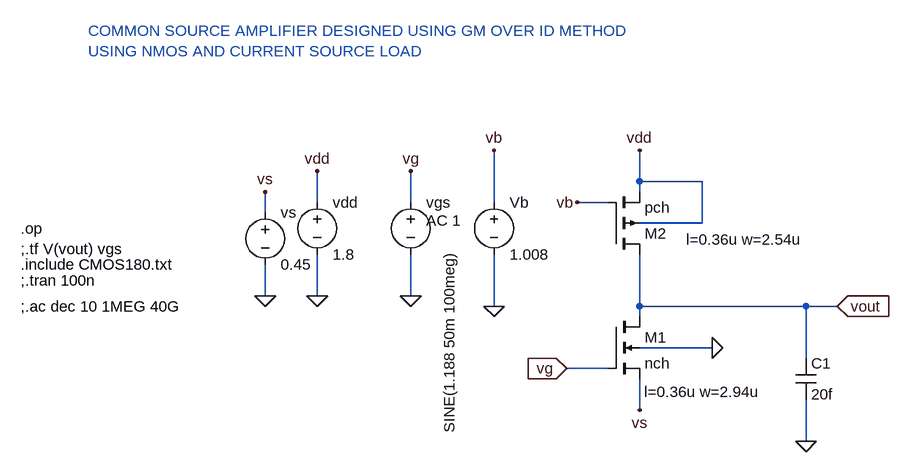
[diagram p0: schematic CS AMP FOR ONE STAGE OPAMP new.asc]
CS AMP FOR ONE STAGE OPAMP new.asc, the LTspice schematic file:
Version 4
SHEET 1 880 680
WIRE 368 96 368 48
WIRE 464 96 368 96
WIRE 368 112 368 96
WIRE -128 128 -128 80
WIRE 16 128 16 80
WIRE 144 128 144 48
WIRE 320 128 272 128
WIRE -208 144 -208 112
WIRE 464 160 464 96
WIRE 464 160 368 160
WIRE -208 272 -208 224
WIRE -128 272 -128 208
WIRE 16 272 16 208
WIRE 144 288 144 208
WIRE 368 288 368 208
WIRE 624 288 368 288
WIRE 672 288 624 288
WIRE 368 304 368 288
WIRE 480 352 368 352
WIRE 624 368 624 288
WIRE 320 384 256 384
WIRE 368 448 368 400
WIRE 624 496 624 432
FLAG 16 272 0
FLAG -128 272 0
FLAG -208 272 0
FLAG -208 112 vs
FLAG -128 80 vdd
FLAG 16 80 vg
FLAG 256 384 vg
IOPIN 256 384 In
FLAG 672 288 vout
IOPIN 672 288 In
FLAG 624 496 0
FLAG 368 48 vdd
FLAG 144 288 0
FLAG 144 48 vb
FLAG 272 128 vb
FLAG 368 448 vs
FLAG 480 352 0
DATAFLAG 368 240 ""
DATAFLAG 368 240 ""
SYMBOL nmos4 320 304 R0
WINDOW 123 55 116 Left 2
SYMATTR Value2 l=0.36u w=2.94u
SYMATTR InstName M1
SYMATTR Value nch
SYMBOL voltage 16 112 R0
WINDOW 3 59 90 VRight 2
WINDOW 123 24 44 Left 2
WINDOW 39 0 0 Left 0
SYMATTR Value SINE(1.188 50m 100meg)
SYMATTR Value2 AC 1
SYMATTR InstName vgs
SYMBOL voltage -128 112 R0
WINDOW 123 0 0 Left 0
WINDOW 39 0 0 Left 0
SYMATTR InstName vdd
SYMATTR Value 1.8
SYMBOL cap 608 368 R0
SYMATTR InstName C1
SYMATTR Value 20f
SYMBOL pmos4 320 208 M180
WINDOW 123 120 23 Left 2
SYMATTR Value2 l=0.36u w=2.54u
SYMATTR InstName M2
SYMATTR Value pch
SYMBOL voltage 144 112 R0
WINDOW 123 0 0 Left 0
WINDOW 39 0 0 Left 0
SYMATTR InstName Vb
SYMATTR Value 1.008
SYMBOL voltage -208 128 R0
WINDOW 123 0 0 Left 0
WINDOW 39 0 0 Left 0
SYMATTR InstName vs
SYMATTR Value 0.45
TEXT -584 224 Left 2 !.include CMOS180.txt
TEXT -584 168 Left 2 !.op
TEXT -584 200 Left 2 !;.tf V(vout) vgs
TEXT -584 248 Left 2 !;.tran 100n
TEXT -480 -136 Left 2 ;COMMON SOURCE AMPLIFIER DESIGNED USING GM OVER ID METHOD \nUSING NMOS AND CURRENT SOURCE LOAD
TEXT -584 288 Left 2 !;.ac dec 10 1MEG 40G

The netlist it stands for:
* CS AMP FOR ONE STAGE OPAMP new.asc
M1 vout vg vs 0 nch l=0.36u w=2.94u
vgs vg 0 SINE(1.188 50m 100meg) AC 1
vdd vdd 0 1.8
C1 vout 0 20f
M2 vout vb vdd vdd pch l=0.36u w=2.54u
Vb vb 0 1.008
vs vs 0 0.45
.model NMOS NMOS
.model PMOS PMOS
.lib standard.mos
.include CMOS180.txt
.op
;.tf V(vout) vgs
;.tran 100n
* COMMON SOURCE AMPLIFIER DESIGNED USING GM OVER ID METHOD
* USING NMOS AND CURRENT SOURCE LOAD
;.ac dec 10 1MEG 40G
.backanno
.end

* Results of the author's LTspice run, read from the files saved beside the schematic
* Operating Point:
*   V(vout) = 1.173 V
*   V(vg) = 1.188 V
*   V(vs) = 450 mV
*   V(vdd) = 1.8 V
*   V(vb) = 1.008 V
*   Id(M2) = -28.67 µA
*   Ig(M2) = 0 A
*   Ib(M2) = 637.5 fA
*   Is(M2) = 28.67 µA
*   Id(M1) = 28.67 µA
*   Ig(M1) = 0 A
*   Ib(M1) = -1.643 pA
*   Is(M1) = -28.67 µA
*   I(C1) = 0 A
*   I(Vs) = 28.67 µA
*   I(Vb) = 0 A
*   I(Vdd) = -28.67 µA
*   I(Vgs) = 0 A
* From the log:
*   Semiconductor Device Operating Points:
*                           --- BSIM3 MOSFETS ---
*   Name:        m2          m1
*   Model:       pch         nch
*   Id:       -2.87e-05    2.87e-05
*   Vgs:      -7.92e-01    7.38e-01
*   Vds:      -6.27e-01    7.23e-01
*   Vbs:       0.00e+00   -4.50e-01
*   Vth:      -4.48e-01    5.81e-01
*   Vdsat:    -2.77e-01    1.38e-01
*   Gm:        1.51e-04    3.43e-04
*   Gds:       4.21e-06    4.44e-06
*   Gmb        4.76e-05    7.79e-05
*   Cbd:       0.00e+00    0.00e+00
*   Cbs:       0.00e+00    0.00e+00
*   Cgsov:     1.67e-15    1.44e-15
*   Cgdov:     1.67e-15    1.44e-15
*   Cgbov:     2.98e-19    3.28e-19
*   dQgdVgb:   8.72e-15    9.61e-15
*   dQgdVdb:  -1.67e-15   -1.40e-15
*   dQgdVsb:  -6.79e-15   -7.78e-15
*   dQddVgb:  -1.69e-15   -1.45e-15
*   dQddVdb:   1.68e-15    1.45e-15
*   dQddVsb:   7.72e-18    7.50e-18
*   dQbdVgb:  -1.13e-15   -1.36e-15
*   dQbdVdb:  -4.62e-18    1.55e-18
*   dQbdVsb:  -4.84e-16   -3.83e-16